# EAGLE design Marvin_1.0 (EAGLE 7.5.0)
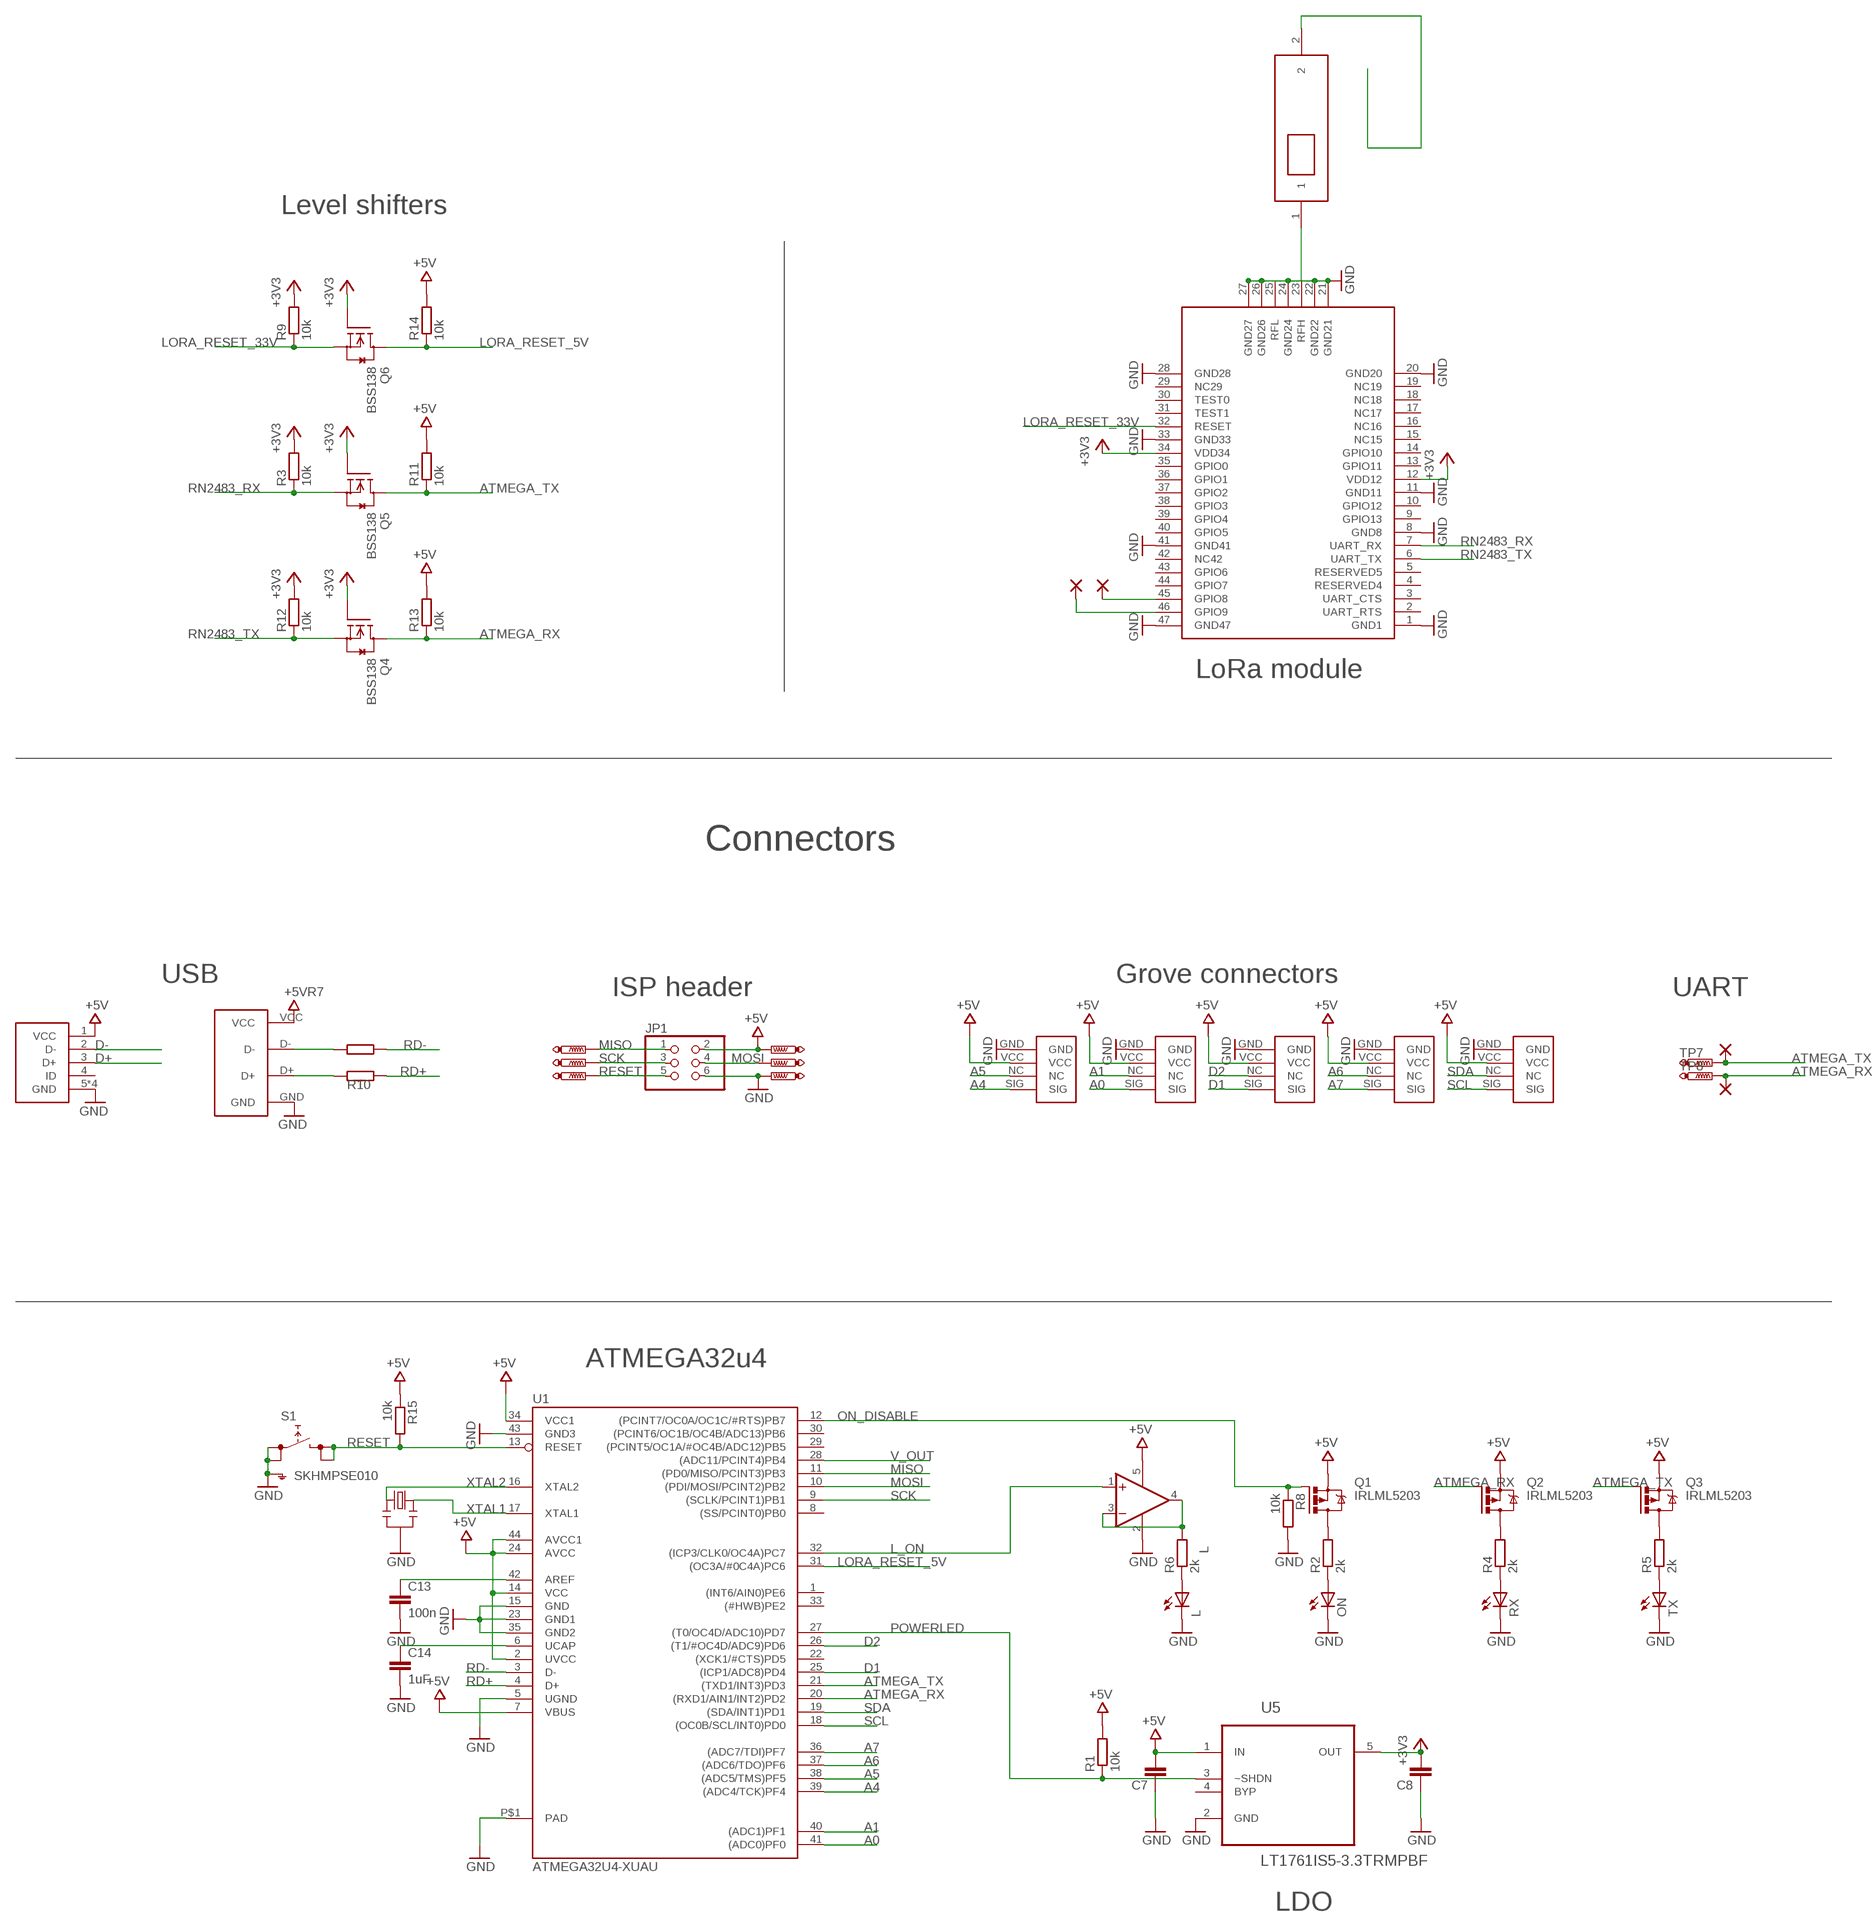
[diagram p0: schematic, sheet 1]

## Parts
A1  GROVE  [4POS2MM]
A2  GROVE  [4POS2MM]
A3  GROVE  [4POS2MM]
C7  C-EUC0603  [C0603]
C8  C-EUC0603  [C0603]
C13  100n  C-EUC0603K  [C0603K]
C14  1uF  C-EUC0603K  [C0603K]
D2  GROVE  [4POS2MM]
D2/I2C  GROVE  [4POS2MM]
IC1  LM321MF  [SOT23-5]
JP1  PINHD-2X3  [2X03]
L  LEDSML0603  [SML0603]
ON  LEDSML0603  [SML0603]
PAD1  WIREPAD1,6/0,9  [1,6/0,9]
PAD2  WIREPAD1,6/0,9  [1,6/0,9]
PAD3  WIREPAD1,6/0,9  [1,6/0,9]
PAD4  WIREPAD1,6/0,9  [1,6/0,9]
Q1  IRLML5203  [MICRO3]
Q2  IRLML5203  [MICRO3]
Q3  IRLML5203  [MICRO3]
Q4  BSS138  [SOT23]
Q5  BSS138  [SOT23]
Q6  BSS138  [SOT23]
R1  10k  R-EU_R0603  [R0603]
R2  2k  R-EU_R0603  [R0603]
R3  10k  R-EU_R0603  [R0603]
R4  2k  R-EU_R0603  [R0603]
R5  2k  R-EU_R0603  [R0603]
R6  2k  R-EU_R0603  [R0603]
R7  30  R-EU_R0603  [R0603-ROUND]
R8  10k  R-EU_R0603  [R0603]
R9  10k  R-EU_R0603  [R0603]
R10  30  R-EU_R0603  [R0603-ROUND]
R11  10k  R-EU_R0603  [R0603]
R12  10k  R-EU_R0603  [R0603]
R13  10k  R-EU_R0603  [R0603]
R14  10k  R-EU_R0603  [R0603]
R15  10k  R-EU_R0603  [R0603]
RX  LEDSML0603  [SML0603]
S1  SKHMPSE010  [SKHMPXE010]
TP1  PTR1B1,27  [B1,27]
TP2  PTR1B1,27  [B1,27]
TP3  PTR1B1,27  [B1,27]
TP4  PTR1B1,27  [B1,27]
TP5  PTR1B1,27  [B1,27]
TP6  PTR1B1,27  [B1,27]
TP7  PTR1B1,27  [B1,27]
TP8  PTR1B1,27  [B1,27]
TX  LEDSML0603  [SML0603]
U1  ATMEGA32U4-XUAU  [TQFP44-PAD]
U5  LT1761IS5-3.3TRMPBF  [SOT95P280X100-5N]
U$1  RN2483  [RN2483]
U$3  USBA  [USBAPLUG]
U$16  USB-VERTICAL  [MICROUSBVERTICAL]
U$25  868AT  [868AT]
Y1  CSTCE16M0V53-R0 16MHZ  RESONATORMU  [RESONATOR]

## Nets
+3V3: C8.2 Q4.1(G) Q5.1(G) Q6.1(G) R3.2 R9.2 R12.2 U5.5(OUT) U$1.12(VDD12) U$1.34(VDD34)
+5V: A1.VCC A2.VCC A3.VCC C7.2 D2.VCC D2/I2C.VCC IC1.5(V+) JP1.2 Q1.2(S) Q2.2(S) Q3.2(S) R1.2 R11.2 R13.2 R14.2 R15.1 TP6.TP U1.2(UVCC) U1.7(VBUS) U1.14(VCC) U1.24(AVCC) U1.34(VCC1) U1.44(AVCC1) U5.1(IN) U$3.VCC U$16.1(VCC)
A0: A1.SIG U1.41((ADC0)PF0)
A1: A1.NC U1.40((ADC1)PF1)
A4: A2.SIG U1.39((ADC4/TCK)PF4)
A5: A2.NC U1.38((ADC5/TMS)PF5)
A6: A3.NC U1.37((ADC6/TDO)PF6)
A7: A3.SIG U1.36((ADC7/TDI)PF7)
AREF1: C13.1 U1.42(AREF)
ATMEGA_RX: PAD2.1(P) Q2.1(G) Q4.3(D) R13.1 TP8.TP U1.20((RXD1/AIN1/INT2)PD2)
ATMEGA_TX: PAD1.1(P) Q3.1(G) Q5.3(D) R11.1 TP7.TP U1.21((TXD1/INT3)PD3)
D1: D2.SIG U1.25((ICP1/ADC8)PD4)
D2: D2.NC U1.26((T1/#OC4D/ADC9)PD6)
D+: R10.2 U$3.D+ U$16.3(D+)
D-: R7.2 U$3.D- U$16.2(D-)
GND: A1.GND A2.GND A3.GND C7.1 C8.1 C13.2 C14.2 D2.GND D2/I2C.GND IC1.2(V-) JP1.6 L.C ON.C R8.2 RX.C S1.1(1.1) S1.2(1.2) S1.5(SH) TP4.TP TX.C U1.5(UGND) U1.15(GND) U1.23(GND1) U1.35(GND2) U1.43(GND3) U1.P$1(PAD) U5.2(GND) U$1.1(GND1) U$1.8(GND8) U$1.11(GND11) U$1.20(GND20) U$1.21(GND21) U$1.22(GND22) U$1.24(GND24) U$1.26(GND26) U$1.27(GND27) U$1.28(GND28) U$1.33(GND33) U$1.41(GND41) U$1.47(GND47) U$3.GND U$16.5(GND) U$16.P$1(GND) U$16.P$2(GND) U$16.P$3(GND) Y1.2
L: IC1.3(-IN) IC1.4(OUT) R6.2
L_ON: IC1.1(+IN) U1.32((ICP3/CLK0/OC4A)PC7)
LORA_RESET_5V: Q6.3(D) R14.1 U1.31((OC3A/#0C4A)PC6)
LORA_RESET_33V: Q6.2(S) R9.1 U$1.32(RESET)
MISO: JP1.1 TP1.TP U1.11((PD0/MISO/PCINT3)PB3)
MOSI: JP1.4 TP5.TP U1.10((PDI/MOSI/PCINT2)PB2)
N$1: ON.A R2.1
N$2: R4.1 RX.A
N$3: R5.1 TX.A
N$4: L.A R6.1
N$7: Q1.3(D) R2.2
N$8: PAD3.1(P) U$1.46(GPIO9)
N$9: Q2.3(D) R4.2
N$10: Q3.3(D) R5.2
N$11: PAD4.1(P) U$1.45(GPIO8)
N$13: U$25.2
ON_DISABLE: Q1.1(G) R8.1 U1.12((PCINT7/OC0A/OC1C/#RTS)PB7)
POWERLED: R1.1 U1.27((T0/OC4D/ADC10)PD7) U5.3(~SHDN)
RD+: R10.1 U1.4(D+)
RD-: R7.1 U1.3(D-)
RESET: JP1.5 R15.2 S1.3(2.1) S1.4(2.2) TP3.TP U1.13(RESET)
RFH: U$1.23(RFH) U$25.1
RN2483_RX: Q5.2(S) R3.1 U$1.7(UART_RX)
RN2483_TX: Q4.2(S) R12.1 U$1.6(UART_TX)
SCK: JP1.3 TP2.TP U1.9((SCLK/PCINT1)PB1)
SCL: D2/I2C.SIG U1.18((OC0B/SCL/INT0)PD0)
SDA: D2/I2C.NC U1.19((SDA/INT1)PD1)
UCAP: C14.1 U1.6(UCAP)
V_OUT: U1.28((ADC11/PCINT4)PB4)
XTAL1: U1.17(XTAL1) Y1.3
XTAL2: U1.16(XTAL2) Y1.1
Unconnected: U1.1((INT6/AIN0)PE6) U1.8((SS/PCINT0)PB0) U1.22((XCK1/#CTS)PD5) U1.29((PCINT5/OC1A/#OC4B/ADC12)PB5) U1.30((PCINT6/OC1B/OC4B/ADC13)PB6) U1.33((#HWB)PE2) U5.4(BYP) U$1.2(UART_RTS) U$1.3(UART_CTS) U$1.4(RESERVED4) U$1.5(RESERVED5) U$1.9(GPIO13) U$1.10(GPIO12) U$1.13(GPIO11) U$1.14(GPIO10) U$1.15(NC15) U$1.16(NC16) U$1.17(NC17) U$1.18(NC18) U$1.19(NC19) U$1.25(RFL) U$1.29(NC29) U$1.30(TEST0) U$1.31(TEST1) U$1.35(GPIO0) U$1.36(GPIO1) U$1.37(GPIO2) U$1.38(GPIO3) U$1.39(GPIO4) U$1.40(GPIO5) U$1.42(NC42) U$1.43(GPIO6) U$1.44(GPIO7) U$16.4(ID)

## Notes on the sheet
- Level shifters
- LoRa module
- Connectors
- USB | Grove connectors
- ISP header | UART
- ATMEGA32u4
- LDO

## Library data of the parts
A1-A3 D2 D2/I2C = GROVE_vertical:GROVE
C7 C8 = rcl:C-EU: CAPACITOR, European symbol
C13 C14 = SmartPrj:C-EU: CAPACITOR, European symbol
IC1 = linear:LM321?*: Low Power Single Op Amp Source: http://cache.national.com/ds/LM/LM321.pdf
JP1 = pinhead:PINHD-2X3: PIN HEADER
L ON RX TX = led:LED: LED OSRAM: - CHIPLED LG R971, LG N971, LY N971, LG Q971, LY Q971, LO R971, LY R971 LH N974, LH R974 LS Q976, LO Q976, LY Q976 LO Q996 - Hyper CHIPLED LW Q18S LB Q993, LB Q99A, LB R99A - SideLED LS A670, LO A670, LY A670, LG A670, LP A670 LB A673, LV A673, LT A673, LW A673 LH A674 LY A675 LS A676, LA A676, LO A676, LY A676, LW A676 LS A679, LY A679, LG A679 - Hyper Micro SIDELED® LS Y876, LA Y876, LO Y876, LY Y876 LT Y87S - SmartLED LW L88C, LW L88S LB L89C, LB L89S, LG L890 LS L89K, LO L89K, LY L89K LS L896, LA L896, LO L896, LY L896 - TOPLED LS T670, LO T670, LY T670, LG T670, LP T670 LSG T670, LSP T670, LSY T670, LOP T670, LYG T670 LG T671, LOG T671, LSG T671 LB T673, LV T673, LT T673, LW T673 LH T674 LS T676, LA T676, LO T676, LY T676, LB T676, LH T676, LSB T676, LW T676 LB T67C, LV T67C, LT T67C, LS T67K, LO T67K, LY T67K, LW E67C LS E67B, LA E67B, LO E67B, LY E67B, LB E67C, LV E67C, LT E67C LW T67C LS T679, LY T679, LG T679 LS T770, LO T770, LY T770, LG T770, LP T770 LB T773, LV T773, LT T773, LW T773 LH T774 LS E675, LA E675, LY E675, LS T675 LS T776, LA T776, LO T776, LY T776, LB T776 LHGB T686 LT T68C, LB T68C - Hyper Mini TOPLED® LB M676 - Mini TOPLED Santana® LG M470 LS M47K, LO M47K, LY M47K Source: http://www.osram.convergy.de LUXEON: - LUMILED® LXK2-PW12-R00, LXK2-PW12-S00, LXK2-PW14-U00, LXK2-PW14-V00 LXK2-PM12-R00, LXK2-PM12-S00, LXK2-PM14-U00 LXK2-PE12-Q00, LXK2-PE12-R00, LXK2-PE12-S00, LXK2-PE14-T00, LXK2-PE14-U00 LXK2-PB12-K00, LXK2-PB12-L00, LXK2-PB12-M00, LXK2-PB14-N00, LXK2-PB14-P00, LXK2-PB14-Q00 LXK2-PR12-L00, LXK2-PR12-M00, LXK2-PR14-Q00, LXK2-PR14-R00 LXK2-PD12-Q00, LXK2-PD12-R00, LXK2-PD12-S00 LXK2-PH12-R00, LXK2-PH12-S00 LXK2-PL12-P00, LXK2-PL12-Q00, LXK2-PL12-R00 Source: www.luxeon.com KINGBRIGHT: KA-3528ASYC Source: www.kingbright.com
PAD1-PAD4 = wirepad:WIREPAD: Wire PAD connect wire on PCB
Q1-Q3 = transistor-power:IRLML5203: HEXFET P-Channel Power MOSFET
Q4-Q6 = m-pad-2.1:BSS138: Fairchild Semiconductors BSS138 N-Channel Logic Level Enhancement Mode Field Effect Transistor General Description: These N-Channel enhancement mode field effect transistors are produced using Fairchild's proprietary, high cell density, DMOS technology. These products have been designed to minimize on-state resistance while provide rugged, reliable, and fast switching performance.These products are particularly suited for low voltage, low current applications such as small servo motor control, power MOSFET gate drivers, and other switching applications. Features: 0.22 A, 50 V. RDS(ON) = 3.5Ohm @ VGS = 10 V RDS(ON) = 6.0Ohm @ VGS = 4.5 V High density cell design for extremely low RDS(ON) Rugged and Reliable Compact industry standard SOT-23 surface mount package Please send any comments to: messi@users.sourceforge.net
R1-R6 R8 R9 R11-R15 = rcl:R-EU_: RESISTOR, European symbol
R7 R10 = SmartPrj:R-EU_: RESISTOR, European symbol
S1 = switch:SKHMP*E010: 6.2 X 6.5mm TACT Switch (SMD) Source: http://www3.alps.co.jp/WebObjects/catalog.woa/PDF/E/Switch/Tact/SKHM/SKHM.PDF
TP1-TP8 = testpad:PTR1: TEST PIN
U1 = SmartPrj:ATMEGA32U4-XU
U5 = LTC_By_element14_Batch_1:LT1761IS5-3.3TRMPBF: LDO Micropower Regulators; MPN: LT1761IS5-3.3#TRMPBF; OC_FARNELL: -; OC_NEWARK: 24R3345; PACKAGE: TSOT-23-5; SUPPLIER: Linear Technology
U$1 = RN2483:RN2483
U$3 = usba:USBA
U$16 = usb-micro-vertical:USB-VERTICAL
U$25 = 868AT43_antenna:868AT
Y1 = SmartPrj:RESONATOR

## Net classes
0 default: width 0.254 mm, drill 0.61 mm, clearance 0.254 mm

## Board
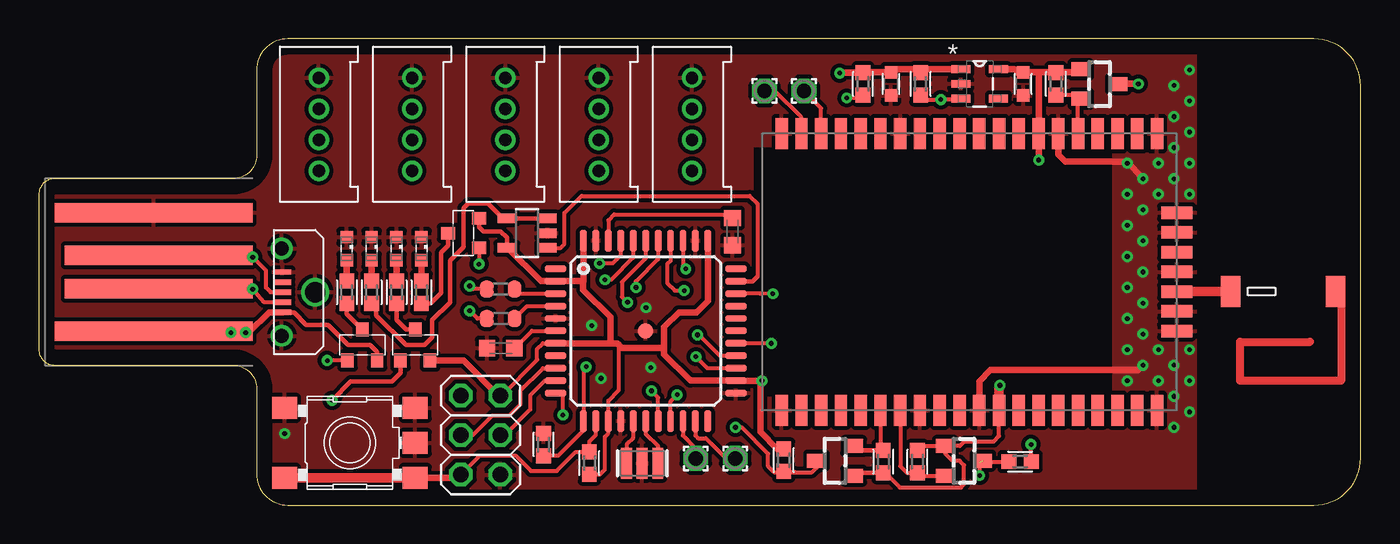
[diagram p1: board, top side]
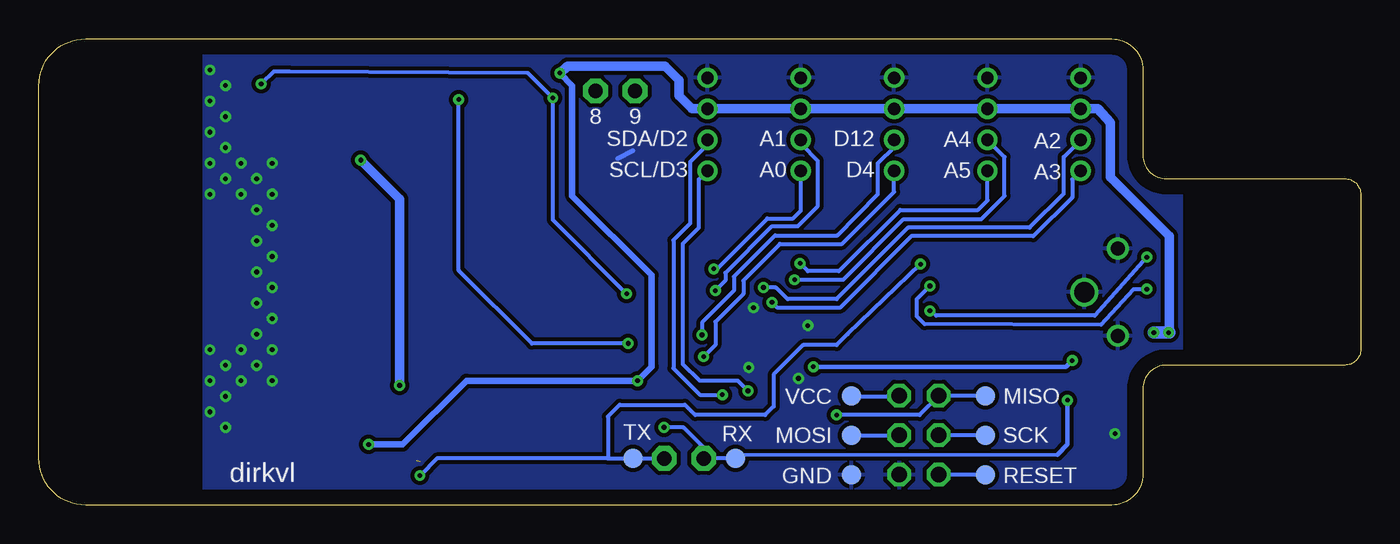
[diagram p2: board, bottom side, seen from below]

Size 85 x 30 mm. Coordinates in mm from the lower left corner, seen from the top.
Outline: 14,7.5 14,2 arc90 16,0 82,0 arc90 85,3 85,27 arc90 82,30 16,30 arc90 14,28 14,22.5 arc-90 12.5,21 1,21 arc90 0,20 0,10 arc90 1,9 12.5,9 arc-90 14,7.5
Copper layers (1*16): Top 0.035mm / dielectric 1.5mm / Bottom 0.035mm
Design rules "default *": minimum track width 10mil, minimum drill 24mil, track to track 8mil, track to pad 8mil, pad to pad 8mil, via to via 8mil, smd to smd 8mil, copper to edge 40mil, drill to drill 8mil, minimum pad ring 10mil, minimum via ring 8mil, stop-mask expansion 4mil, vias tented up to drill 0mil, thermal gap 10mil
tRestrict: area 46,7 to 69,23; area 74.5,0 to 85,30
bRestrict: area 0,9 to 11.4,21; area 74.5,0 to 85,30

### Footprints (pad centres in the part's own frame; a part is rotated, then mirrored left to right if it is on the bottom)
4POS2MM = drill 0.8: GND 3,0; NC -1,0; SIG -3,0; VCC 1,0
C0603 = smd 0.8 x 0.8: 1 -0.75,0; 2 0.75,0
C0603K = smd 1.05 x 1.08: 1 -0.875,0; 2 0.875,0
SOT23-5 = smd 0.6 x 1.2: 1 -0.95,-1.306; 2 0,-1.306; 3 0.95,-1.306; 4 0.95,1.306; 5 -0.95,1.306
2X03 = drill 1.016 octagon: 1 -2.54,-1.27; 2 -2.54,1.27; 3 0,-1.27; 4 0,1.27; 5 2.54,-1.27; 6 2.54,1.27
SML0603 = smd 0.8 x 0.8: A 0.75,0; C -0.75,0
1,6/0,9 = drill 0.914 pad 1.6 octagon: 1 0,0
MICRO3 = smd 0.8 x 0.9: 1 -0.95,-1; 2 0.95,-1; 3 0,1
SOT23 = smd 0.9 x 1.2: 1 -0.95,-1.2; 2 0.95,-1.2; 3 0,1.2
R0603 = smd 0.95 x 0.95: 1 -0.725,0; 2 0.725,0
R0603-ROUND = smd 0.898 x 1.1: 1 -0.889,0; 2 0.889,0
SKHMPXE010 = smd 1.6 x 1.4: 1 -4.2,2.25; 2 4.2,2.25; 3 -4.2,-2.25; 4 4.2,-2.25; 5 4.2,0
B1,27 = smd 1.27 x 1.27: TP 0,0
TQFP44-PAD = smd 1.4 x 0.45: 1 -5.8,4; 2 -5.8,3.2; 3 -5.8,2.4; 4 -5.8,1.6; 5 -5.8,0.8; 6 -5.8,0; 7 -5.8,-0.8; 8 -5.8,-1.6; 9 -5.8,-2.4; 10 -5.8,-3.2; 11 -5.8,-4; 23 5.8,-4; 24 5.8,-3.2; 25 5.8,-2.4; 26 5.8,-1.6; 27 5.8,-0.8; 28 5.8,0; 29 5.8,0.8; 30 5.8,1.6; 31 5.8,2.4; 32 5.8,3.2; 33 5.8,4 | smd 0.45 x 1.4: 12 -4,-5.8; 13 -3.2,-5.8; 14 -2.4,-5.8; 15 -1.6,-5.8; 16 -0.8,-5.8; 17 0,-5.8; 18 0.8,-5.8; 19 1.6,-5.8; 20 2.4,-5.8; 21 3.2,-5.8; 22 4,-5.8; 34 4,5.8; 35 3.2,5.8; 36 2.4,5.8; 37 1.6,5.8; 38 0.8,5.8; 39 0,5.8; 40 -0.8,5.8; 41 -1.6,5.8; 42 -2.4,5.8; 43 -3.2,5.8; 44 -4,5.8 | smd 1 x 1: P$1 0,0
SOT95P280X100-5N = smd 1.219 x 0.508: 1 -1.219,0.94; 2 -1.219,0; 3 -1.219,-0.94; 4 1.219,-0.94; 5 1.219,0.94
RN2483 = smd 2 x 0.8: 1 17.8,1.27; 2 17.8,2.54; 3 17.8,3.81; 4 17.8,5.08; 5 17.8,6.35; 6 17.8,7.62; 7 17.8,8.89; 8 17.8,10.16; 9 17.8,11.43; 10 17.8,12.7; 11 17.8,13.97; 12 17.8,15.24; 13 17.8,16.51; 14 17.8,17.78; 15 17.8,19.05; 16 17.8,20.32; 17 17.8,21.59; 18 17.8,22.86; 19 17.8,24.13; 20 17.8,25.4; 28 0,25.4; 29 0,24.13; 30 0,22.86; 31 0,21.59; 32 0,20.32; 33 0,19.05; 34 0,17.78; 35 0,16.51; 36 0,15.24; 37 0,13.97; 38 0,12.7; 39 0,11.43; 40 0,10.16; 41 0,8.89; 42 0,7.62; 43 0,6.35; 44 0,5.08; 45 0,3.81; 46 0,2.54; 47 0,1.27 | smd 0.8 x 2: 21 12.7,26.67; 22 11.43,26.67; 23 10.16,26.67; 24 8.89,26.67; 25 7.62,26.67; 26 6.35,26.67; 27 5.08,26.67
USBAPLUG = smd 1.27 x 12.065: D+ 1.079,6.032; D- -1.079,6.032 | smd 1.27 x 12.7: GND 3.81,6.35; VCC -3.81,6.35
MICROUSBVERTICAL = smd 0.35 x 1.1: 1 -1.3,1.025; 2 -0.65,1.025; 3 0,1.025; 4 0.65,1.025; 5 1.3,1.025 | drill 0.9: P$1 -2.8,1.075; P$2 2.8,1.075 | drill 1.3: P$3 0,-1.075
868AT = smd 1.25 x 2: 1 0.625,1; 2 7.375,1
RESONATOR = smd 0.7 x 2: 1 -1,0; 2 0,0; 3 1,0

### Placement (x,y rotation side)
A1  24,24.5 90 top
A2  18,24.5 90 top
A3  36,24.5 90 top
C7  54.8,27.1 90 top
C8  63.3,27.1 90 top
C13  44.6,17.6 270 top
C14  29.7,10.1 180 top
D2  30,24.5 90 top
D2/I2C  42,24.5 90 top
IC1  31.4,17.5 90 top
JP1  28.4,4.5 270 top
L  21.4,16.5 270 top
ON  19.8,16.5 270 top
PAD1  44.78,3 0 top
PAD2  42.24,3 0 top
PAD3  46.66,26.65 0 top
PAD4  49.2,26.65 0 top
Q1  20.8,10.3 0 top
Q2  24.2,10.3 0 top
Q3  27.3,17.5 90 top
Q4  51.2,2.85 90 top
Q5  59.5,2.85 270 top
Q6  68.21,27.09 270 top
R1  56.7,27.1 90 top
R2  19.8,13.7 270 top
R3  56.5,2.8 90 top
R4  23,13.7 270 top
R5  24.6,13.7 270 top
R6  21.4,13.7 270 top
R7  29.7,13.9 180 top
R8  32.45,3.9 90 top
R9  65.4,27.1 90 top
R10  29.7,12 180 top
R11  63.1,2.8 0 top
R12  54.3,2.8 270 top
R13  47.9,2.9 90 top
R14  53,27.1 90 top
R15  35.4,2.7 90 top
RX  23,16.5 270 top
S1  20,4 0 top
TP1  24.13,7.02 0 bottom
TP2  24.13,4.48 0 bottom
TP3  24.13,1.94 0 bottom
TP4  32.75,1.94 0 bottom
TP5  32.75,4.48 0 bottom
TP6  32.75,7.02 0 bottom
TP7  46.8,3 0 bottom
TP8  40.2,3 0 bottom
TX  24.6,16.5 270 top
U1  39.02,11.21 0 top
U5  60.5,27.1 0 top
U$1  46.5,23.9 270 top
U$3  13.73,15 90 top
U$16  16.7,13.7 90 top
U$25  76,12.74 0 top
Y1  38.8,2.7 0 top

### Tracks (layer width: path | path; a pad name or v marks a point on that pad's centre or on a via)
+3V3  (via drill 0.3)
  Top 0.254: R12.2 54.42,2.08 55.36,1.14 59.3,1.14 59.5,1.34 59.5,2.56 59.2,2.86 58.75,2.86 58.3,3.31 Q5.1 | R3.2 56.52,3.74 56.58,3.8 Q5.1 | U$1.12 61.74,4.44 61.4,4.1 59.52,4.1 59.22,3.8 Q5.1
  Top 0.305: 54.3,1.85 R12.2 52.62,2.08 Q4.1
  Top 0.406: U5.5 62.71,28.04 C8.2 | 62.95,27.8 C8.2 | 64.3,23.92 v64.3,22.2 64.3,27.85 | C8.2 64.3,27.85 | 64.3,27.85 66,27.85 | 66,27.85 R9.2 65.54,28.04 | Q6.1 66.82,27.85 66,27.85
  Top 0.61: U$1.12 61.74,7.56 v61.8,7.7 | 64.3,23.92 U$1.34
  Bottom 0.61: v61.8,7.7 61.8,19.7 v64.3,22.2
+5V  (via drill 0.3)
  Top 0.254: 29.77,7.07 JP1.2 29.74,7.04 32.05,9.35 32.05,10.05 32.41,10.41 U1.7 | R11.2 v63.8,3.9 | R1.2 56.5,28.04 | R15.1 36.08,1.98 36.4,2.3 36.4,4.4 36.62,4.62 U1.14 36.62,6.72 37.3,7.4 37.3,10.31
  Top 0.305: Q1.2 21.75,9.85 21.3,10.3 19.9,10.3 18.6,11.6 17.2,11.6 16.4,12.4 U$16.1 | IC1.5 30.09,17.21 29.7,17.6 28.6,17.6 28.3,17.9 Q3.2
  Top 0.406: 35,14.41 35.02,14.41 U1.44 | v46.49,8.01 v46.5,8 | 46.3,8 v46.5,8 | U$16.1 14.8,12.4 13.5,11.1 v13.3,11.1 | 35,14.41 U1.2 32.29,14.41 30.15,16.55 IC1.5 | U1.34 43.02,13.12 42.3,12.4 41.15,12.4 40.2,11.45 40.2,10.1 | 40.2,10.1 37.5,10.1 37.19,10.41 | U5.1 56.5,28.04 54.79,28.04 C7.2 52.83,27.85 R14.2 51.73,27.82 v51.5,27.8 | R13.2 47.48,3.62 46.4,4.7 46.4,7.9 v46.5,8 | Q2.2 27.3,9.3 29.56,7.04 JP1.2 | v46.5,8 U1.24 41.89,8.01 40.2,9.7 40.2,10.1 | 37.3,10.31 37.19,10.41 | 37.19,10.41 36.75,10.41 | 36.75,10.41 U1.7 | 35,14.41 35,13.85 36.75,12.1 36.75,10.41
  Top 0.813: U$3.VCC 6.99,11.2 v12.35,11.1 v13.3,11.1
  Bottom 0.254: TP6.TP 32.17,7 30.43,7 JP1.2
  Bottom 0.406: v63.8,3.9 61.6,3.9 57.5,8 v46.5,8 45.6,8.9 45.6,14.8 50.7,19.9 50.7,27 v51.5,27.8
  Bottom 0.61: 12.3,11.1 12.3,17.3 16.1,21.1 16.1,24.6 16.9,25.5 A2.VCC A1.VCC 24.26,25.5 D2.VCC A3.VCC D2/I2C.VCC 43,25.5 43.85,26.35 43.85,27.35 44.75,28.25 51,28.25 v51.5,27.8
  Bottom 0.813: v13.3,11.1 v12.35,11.1 12.3,11.1
A0  (via drill 0.3)
  Top 0.254: U1.41 37.42,16.07 36.9,15.55 v36.05,15.55
  Bottom 0.254: v36.05,15.55 35.55,15.05 33.55,15.05 29.6,19 24.6,19 24,19.6 A1.SIG
A1  (via drill 0.3)
  Top 0.254: U1.40 38.22,15.92 36.8,14.5 v36.4,14.5
  Bottom 0.254: A1.NC 22.9,22.4 22.9,19.9 24.4,18.4 29.4,18.4 33.3,14.5 v36.4,14.5
A4  (via drill 0.3)
  Top 0.254: U1.39 39.02,15.87 37.5,14.35 37.5,13.4 v37.85,13.05
  Bottom 0.254: v37.85,13.05 37.5,12.7 33.5,12.7 28.9,17.3 21.05,17.3 18.55,19.8 18.55,20.95 A2.SIG
A5  (via drill 0.3)
  Top 0.254: U1.38 39.82,15.82 38.4,14.4 v38.4,14
  Bottom 0.254: v38.4,14 37.6,14 36.85,13.25 33.7,13.25 29.1,17.85 21.3,17.85 19.1,20.05 19.1,22.4 A2.NC
A6  (via drill 0.3)
  Top 0.254: U1.37 40.62,15.72 40.4,15.5 40.4,14.3 40.9,13.8 v41.5,13.8
  Bottom 0.254: A3.NC 36,23.25 34.9,22.15 34.9,19.25 36.2,17.95 37.85,17.95 40.85,14.95 40.85,14.45 v41.5,13.8
A7  (via drill 0.3)
  Top 0.254: U1.36 41.42,15.38 v41.6,15.2
  Bottom 0.254: v41.6,15.2 41.4,15.2 38.15,18.45 36.5,18.45 36,18.95 A3.SIG
AREF1
  Top 0.254: C13.1 44.67,18.7 37,18.7 36.62,18.32 U1.42
ATMEGA_RX  (via drill 0.3)
  Top 0.254: 48.62,2.12 R13.1 | 48.62,2.12 47.27,2.12 46.9,2.5 46.9,3.3 45.2,5 v44.8,5 | 48.62,2.12 49.73,2.12 50.01,2.41 | U1.20 41.42,4.48 42.24,3.66 PAD2.1 | Q2.1 23.25,8.85
  Top 0.305: 23.25,8.85 23.25,8.5 22.7,7.95 20.05,7.95 v18.85,6.75 | 50,2.41 50.01,2.41 50.01,3 50,3 Q4.3
  Bottom 0.254: 19.5,3.25 40,3.2 TP8.TP PAD2.1 42.24,3.69 43.55,5 v44.8,5
  Bottom 0.305: 19.5,3.25 18.85,3.9 v18.85,6.75
ATMEGA_TX  (via drill 0.3)  (1 unrouted)
  Top 0.254: v60.5,1.9 60.5,2.79 | U1.21 42.22,4.48 42.4,4.3 42.9,4.3 44.2,3 PAD1.1 | Q3.1 v28.3,15.5 | Q5.3 60.75,2.8 R11.1
  Bottom 0.254: PAD1.1 TP7.TP 48.4,3 | 48.4,3 59.4,3 v60.5,1.9 | v28.3,15.5 33,11 33.7,10.3 35.85,10.3 37.75,8.4 37.75,6.35 38.3,5.8 42.8,5.8 43.45,6.45 47.65,6.45 48.4,5.7 48.4,3
D1  (via drill 0.3)
  Top 0.254: U1.25 42.99,8.81 v42.25,9.55
  Bottom 0.254: v42.25,9.55 41.5,10.3 41.5,11.8 39.7,13.6 39.7,14.45 37.35,16.8 33.35,16.8 30,20.15 D2.SIG
D2  (via drill 0.3)
  Top 0.254: U1.26 43.79,9.61 42.5,10.9 v42.35,10.95
  Bottom 0.254: D2.NC 30,23 31.05,22 31.05,20 33.65,17.35 37.65,17.35 40.3,14.7 40.3,13.8 42.35,11.75 v42.35,10.95
D+  (via drill 0.3)
  Top 0.254: U$3.D+ 13.22,15.98 v13.75,15.95 14.6,15.1 14.6,14 14.9,13.7 U$16.3 | R10.2 28.2,12 v27.7,12.5
  Bottom 0.254: v13.75,15.95 17.1,12.2 27.3,12.2 v27.7,12.5
D-  (via drill 0.3)
  Top 0.254: R7.2 27.9,13.9 v27.7,14.1 | U$3.D- 13.68,13.82 v13.75,13.9 14.5,13.05 U$16.2
  Bottom 0.254: v13.75,13.9 14.6,13.9 16.7,11.6 28.05,11.65 28.55,12.15 28.55,13.25 v27.7,14.1
GND  (via drill 0.3)
  Top 0.406: U$1.33 65.55,22.55 66,22.1 70,22.1 v71,21 | U$1.11 60.47,7.97 61.2,8.7 70.7,8.7 v71,9
  Bottom 0.305: 47.8,22.3 46.8,22.8
  other vias: 71,19 71,15 71,17 71,13 71,11 73,21 73,9 73,23 73,7 15.8,4.6 39.35,8.85 36.15,8.15 35.55,11.55 39.05,12.7 73,5 73,25 73,27 74,26 74,28 74,24 74,22 74,20 74,10 74,8 74,6 70,20 70,18 70,16 70,14 70,12 70,10 72,10 72,20 72,22 72,8 70,8 70,22
  pour Bottom: 14,7.5 14,2 arc90 16,0 82,0 arc90 85,3 85,27 arc90 82,30 16,30 arc90 14,28 14,22.5 arc-90 12.5,21 1,21.03 arc90 0,20.03 0,9.99 arc90 1,8.99 12.5,9 arc-90
  pour Top: 12.5,21 1,21 arc90 0,20 0,10 arc90 1,9 12.59,9 arc-90 14,7.59 14,2 arc90 16,0 82,0 arc90 85,3 85,27 arc90 82,30 16,30 arc90 14,28 14,22.5 arc-90
L
  Top 0.305: IC1.3 IC1.4 29.85,18.45 28.9,19.4 27.6,19.4 27.3,19.1 27.3,16.6 26.45,15.75 26.45,13.05 25.3,11.9 25.3,10.8 24.8,10.3 23.6,10.3 21.7,12.2 21.7,12.68 R6.2
L_ON
  Top 0.254: IC1.1 33.55,16.55 33.8,16.8 33.8,18.8 34.9,19.9 45.7,19.9 46.2,19.4 46.2,14.7
  Top 0.305: 46.2,14.7 45.9,14.4 U1.32
LORA_RESET_5V  (via drill 0.3)
  Top 0.254: v47.2,13.6 46.39,13.61 U1.31 | R14.1 52.73,26.2 v51.95,26.2
  Top 0.406: Q6.3 v70.7,27.1
  Bottom 0.254: v47.2,13.6 51.95,18.35 v51.95,26.2 53.55,27.8 68.9,27.9 69.9,27.9 v70.7,27.1
LORA_RESET_33V
  Top 0.254: U$1.32 66.82,26.15 | 67.2,26.25 66.82,26.15 | 66.82,26.15 66.59,26.38 R9.1
  Top 0.406: 66.82,26.15 66.83,26.14 Q6.2
MISO  (via drill 0.3)
  Top 0.254: v33.7,5.8 33.7,7.19 U1.11
  Bottom 0.254: TP1.TP 24.31,7.04 JP1.1 28.37,5.8 v33.7,5.8
MOSI
  Top 0.254: U1.10 32.56,8.01 31.6,7.05 31.6,6.15 29.95,4.5 JP1.4
  Bottom 0.254: TP5.TP 29.75,4.48 JP1.4
N$1
  Top 0.406: ON.A R2.1
N$2
  Top 0.406: RX.A R4.1
N$3
  Top 0.406: TX.A R5.1
N$4
  Top 0.406: L.A R6.1
N$7
  Top 0.305: Q1.3 19.8,12.3 R2.2
N$8
  Top 0.254: U$1.46 49.04,24.96 47.35,26.65 PAD3.1
N$9
  Top 0.305: R4.2 23,11.9 23.6,11.3 Q2.3
N$10
  Top 0.305: R5.2 25.18,12.97 25.85,13.65 25.85,16.25 26.3,16.7 Q3.3
N$11
  Top 0.254: U$1.45 50.31,25.54 PAD4.1
N$12
  Top 0.5: 83.75,12.9 83.75,8 77.25,8 77.25,10.5 81.75,10.5
ON_DISABLE  (via drill 0.3)
  Top 0.254: v35.2,8.9 35.02,8.72 U1.12 35.02,4.82 33.38,3.17 R8.1 | Q1.1 v18.55,9.3
  Bottom 0.305: v35.2,8.9 18.95,8.9 v18.55,9.3
POWERLED  (via drill 0.3)
  Top 0.254: U5.3 58.82,26.1 v58,26.1 56.77,26.1 R1.1 | v47.1,10.4 46.99,10.41 U1.27
  Bottom 0.254: v47.1,10.4 53.3,10.4 58,15.1 v58,26.1
RD+
  Top 0.254: R10.1 31.4,12.81 U1.4
RD-
  Top 0.254: R7.1 30.88,13.61 U1.3
RESET
  Top 0.254: U1.13 35.82,4.52 35.4,4.1 R15.2 34.52,3.42 33.3,2.2 31.65,2.2 30.65,3.2 28.37,3.2 JP1.5
  Top 0.406: S1.4 26.77,1.75 JP1.5
  Top 0.61: S1.3 S1.4
  Bottom 0.254: TP3.TP 24.31,1.96 JP1.5
RFH
  Top 0.61: U$1.23 U$25.1
RN2483_RX
  Top 0.254: U$1.7 55.39,2.51 55.83,2.08 R3.1 56.81,1.86 56.85,1.9 Q5.2
RN2483_TX
  Top 0.254: U$1.6 54.12,3.94 R12.1
  Top 0.305: 54.3,3.75 R12.1 52.62,3.52 Q4.2
SCK
  Top 0.254: U1.9 32.41,8.81 30.95,7.35 30.95,6.45 30.25,5.75 29.15,5.75 27.9,4.5 JP1.3
  Bottom 0.254: TP2.TP 24.41,4.5 JP1.3
SCL  (via drill 0.3)
  Top 0.254: U1.18 39.82,6.93 v39.4,7.35
  Bottom 0.254: v39.4,7.35 40.05,8 42.5,8 43.6,9.1 43.6,16.8 42.55,17.85 42.55,20.95 D2/I2C.SIG
SDA  (via drill 0.3)
  Top 0.254: U1.19 40.62,6.67 v41.05,7.1
  Bottom 0.254: D2/I2C.NC 42,23.2 43.1,22.1 43.1,18.15 44.2,17.05 44.2,8.8 42.5,7.1 v41.05,7.1 41.2,7
UCAP
  Top 0.254: C14.1 30.8,10.3 31.71,11.21 U1.6
XTAL1
  Top 0.254: U1.17 39.02,4.58 39.8,3.8 Y1.3
XTAL2
  Top 0.254: U1.16 38.2,5.39 38.2,4.3 37.8,3.9 Y1.1

### Text on the board
bPlace: A2 | A4 | D12 | A1 | SDA/D2 | 9 | 8 | A3 | A5 | D4 | A0 | SCL/D3 | VCC | MISO | MOSI | RX | TX | SCK | dirkvl | GND | RESET
tStop: 9 | 8 | ON | L | RX | TX | RESET | Marvin | RX/TX
200bmp: vlman.com